# EAGLE design NeoCoreShield (EAGLE 9.6.2)
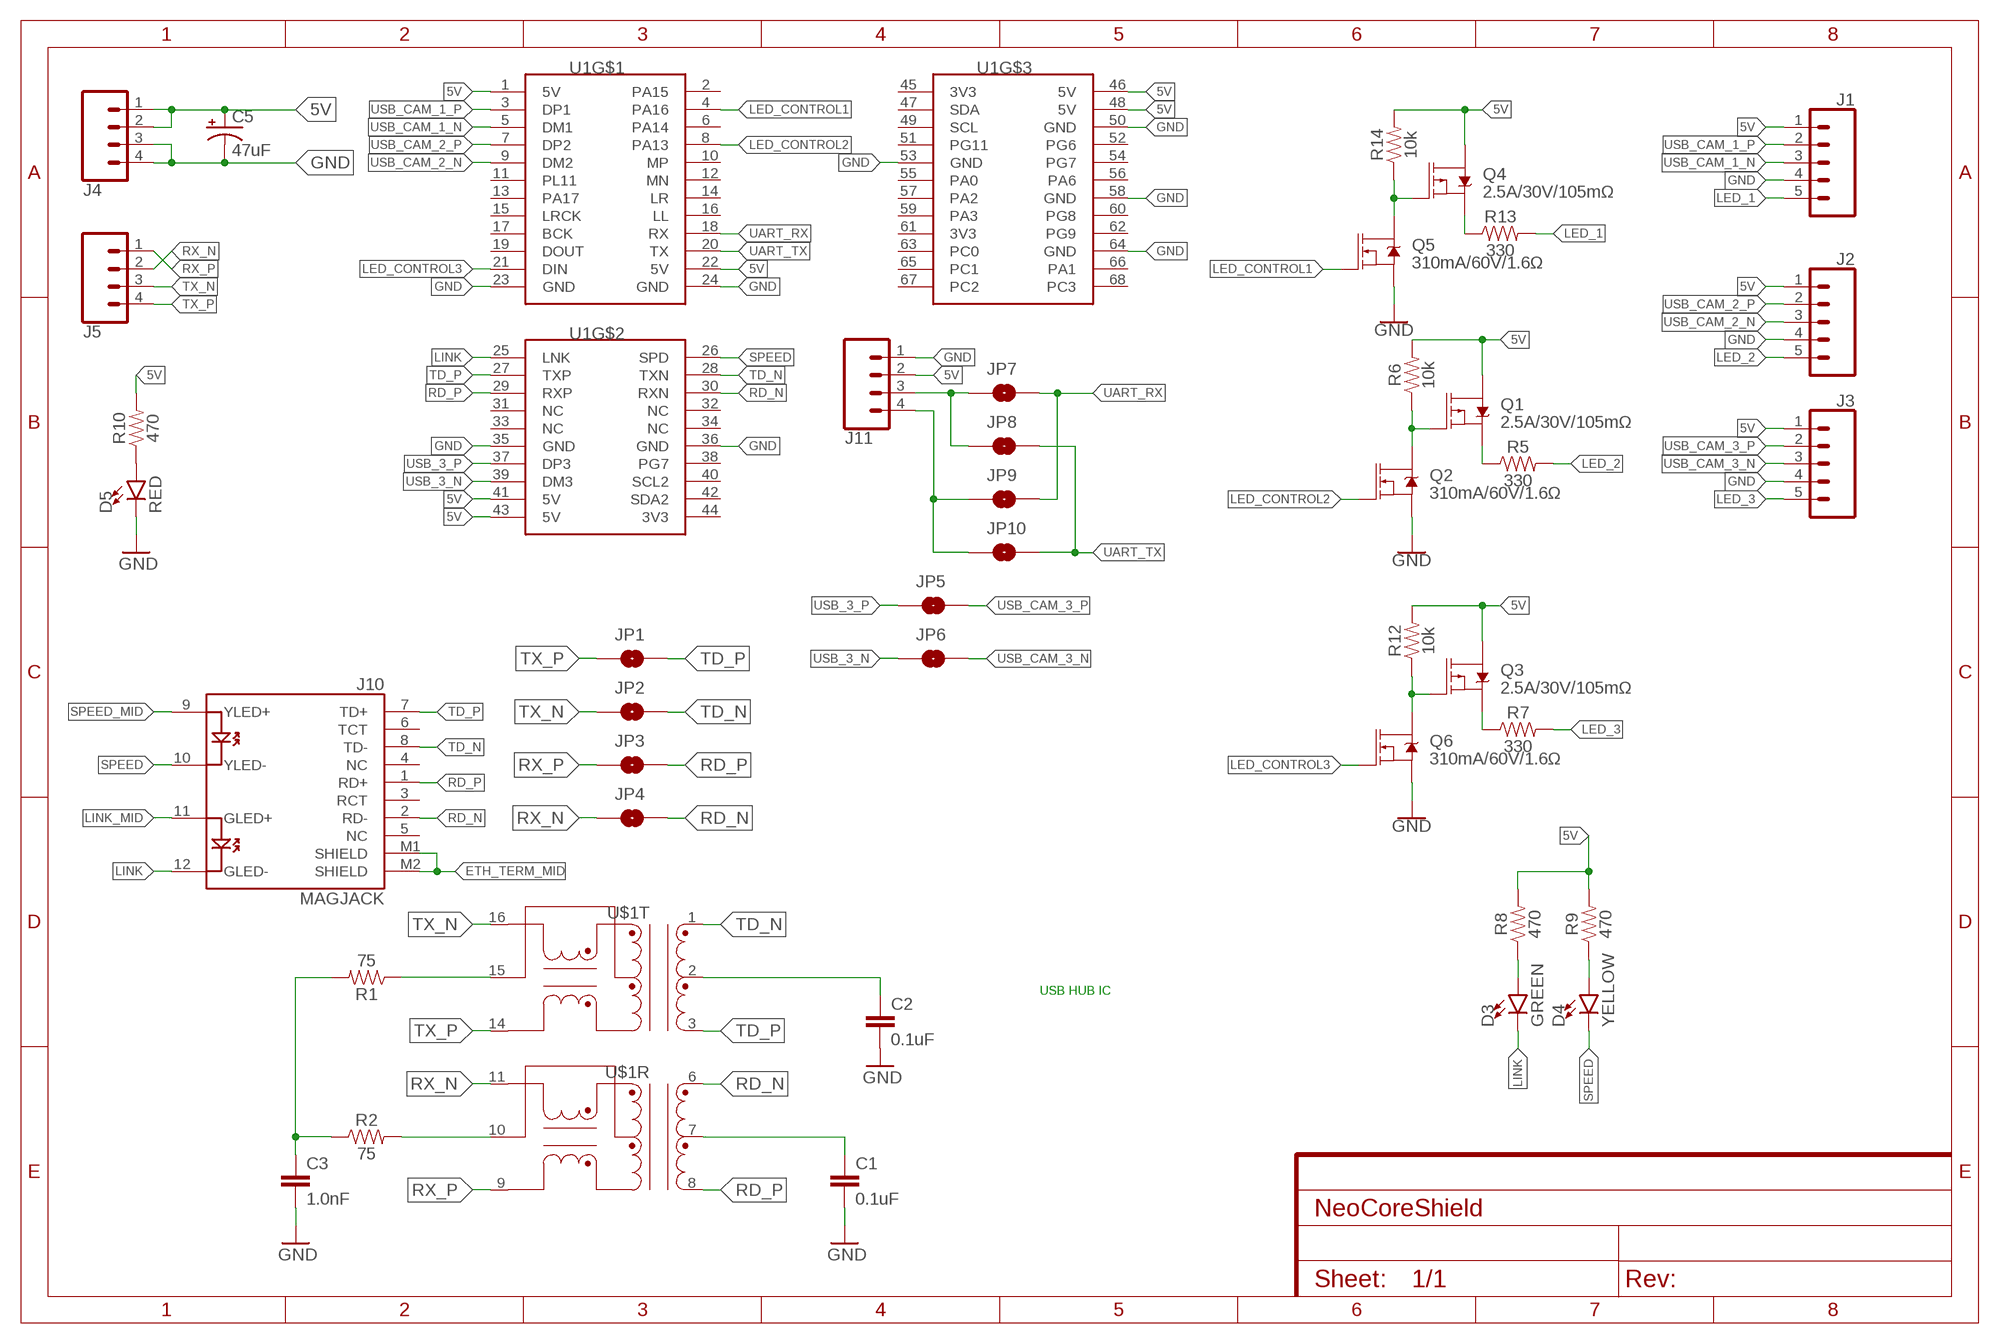
[diagram p0: schematic, sheet 1]

## Parts
C1  0.1uF  0.1UF-0603-25V-(+80/-20%)  [0603]
C2  0.1uF  0.1UF-0603-25V-(+80/-20%)  [0603]
C3  1.0nF  1.0UF-1206-50V-10%  [1206]
C5  47uF  47UF-POLAR-PANASONIC_D-35V-20%  [PANASONIC_D]
D3  GREEN  LED-0805  [0805]
D4  YELLOW  LED-0805  [0805]
D5  RED  LED-0805  [0805]
J1  PXC-PTSM-05-RA  [PXC-PTSM-05-RA]
J2  PXC-PTSM-05-RA  [PXC-PTSM-05-RA]
J3  PXC-PTSM-05-RA  [PXC-PTSM-05-RA]
J4  PXC-PTSM-04-RA-1778641  [PXC-PTSM-04-RA-1778641]
J5  PXC-PTSM-04-RA-1778641  [PXC-PTSM-04-RA-1778641]
J10  MAGJACK  [MAGJACK]
J11  CONN_04  [1X04]
JP1  JUMPER-SMT_2_NO_SILK  [SMT-JUMPER_2_NO_SILK]
JP2  JUMPER-SMT_2_NO_SILK  [SMT-JUMPER_2_NO_SILK]
JP3  JUMPER-SMT_2_NO_SILK  [SMT-JUMPER_2_NO_SILK]
JP4  JUMPER-SMT_2_NO_SILK  [SMT-JUMPER_2_NO_SILK]
JP5  JUMPER-SMT_2_NO_SILK  [SMT-JUMPER_2_NO_SILK]
JP6  JUMPER-SMT_2_NO_SILK  [SMT-JUMPER_2_NO_SILK]
JP7  JUMPER-SMT_2_NO_SILK  [SMT-JUMPER_2_NO_SILK]
JP8  JUMPER-SMT_2_NO_SILK  [SMT-JUMPER_2_NO_SILK]
JP9  JUMPER-SMT_2_NO_SILK  [SMT-JUMPER_2_NO_SILK]
JP10  JUMPER-SMT_2_NO_SILK  [SMT-JUMPER_2_NO_SILK]
Q1  2.5A/30V/105mΩ  MOSFET_PCH-DMG2307L  [SOT23-3]
Q2  310mA/60V/1.6Ω  MOSFET-NCH-2N7002PW  [SOT323]
Q3  2.5A/30V/105mΩ  MOSFET_PCH-DMG2307L  [SOT23-3]
Q4  2.5A/30V/105mΩ  MOSFET_PCH-DMG2307L  [SOT23-3]
Q5  310mA/60V/1.6Ω  MOSFET-NCH-2N7002PW  [SOT323]
Q6  310mA/60V/1.6Ω  MOSFET-NCH-2N7002PW  [SOT323]
R1  75  75KOHM-0603-1/10W-1%  [0603]
R2  75  75KOHM-0603-1/10W-1%  [0603]
R5  330  RESISTOR0805  [0805]
R6  10k  10KOHM-0603-1/10W-1%  [0603]
R7  330  RESISTOR0805  [0805]
R8  470  0OHM-0603-1/10W-5%  [0603]
R9  470  0OHM-0603-1/10W-5%  [0603]
R10  470  0OHM-0603-1/10W-5%  [0603]
R12  10k  10KOHM-0603-1/10W-1%  [0603]
R13  330  RESISTOR0805  [0805]
R14  10k  10KOHM-0603-1/10W-1%  [0603]
U1  NANO_PI_NEO_CORE  [NANO_PI_NEO_CORE]
U$1  ETH-TRANS  [SOIC-16-WIDE]

## Nets
5V: C5.+ J1.1 J2.1 J3.1 J4.1 J4.2 J11.2 Q1.3(D) Q3.3(D) Q4.3(D) R6.2 R8.2 R9.2 R10.2 R12.2 R14.2 U1.1(5V) U1.22(5V) U1.41(5V) U1.43(5V) U1.46(5V) U1.48(5V)
ETH_TD0_GND: C1.1 U$1.7(R:CT)
ETH_TD1_GND: C2.1 U$1.2(T:CT)
ETH_TERM_MID: C3.1 J10.M1(SHIELD) J10.M2(SHIELD) R1.2 R2.1
GND: C1.2 C2.2 C3.2 C5.- D5.C J1.4 J2.4 J3.4 J4.3 J4.4 J11.1 Q2.2(S) Q5.2(S) Q6.2(S) U1.23(GND) U1.24(GND) U1.35(GND) U1.36(GND) U1.50(GND) U1.53(GND) U1.58(GND) U1.64(GND)
LED_1: J1.5 R13.2
LED_2: J2.5 R5.2
LED_3: J3.5 R7.2
LED_CONTROL1: Q5.1(G) U1.4(PA16)
LED_CONTROL2: Q2.1(G) U1.8(PA13)
LED_CONTROL3: Q6.1(G) U1.21(DIN)
LINK: D3.C J10.12(GLED-) U1.25(LNK)
LINK_MID: D3.A J10.11(GLED+) R8.1
N$3: R2.2 U$1.10(R:XCT)
N$5: Q3.2(S) R7.1
N$6: Q3.1(G) Q6.3(D) R12.1
N$7: D5.A R10.1
N$8: Q1.2(S) R5.1
N$9: Q1.1(G) Q2.3(D) R6.1
N$10: Q4.2(S) R13.1
N$11: R1.1 U$1.15(T:XCT)
N$12: Q4.1(G) Q5.3(D) R14.1
RD_N [diff]: J10.2(RD-) JP4.2 U1.30(RXN) U$1.6(R:D+)
RD_P [diff]: J10.1(RD+) JP3.2 U1.29(RXP) U$1.8(R:D-)
RX_N [diff]: J5.2 JP4.1 U$1.11(R:X+)
RX_P [diff]: J5.1 JP3.1 U$1.9(R:X-)
SPEED: D4.C J10.10(YLED-) U1.26(SPD)
SPEED_MID: D4.A J10.9(YLED+) R9.1
TD_N [diff]: J10.8(TD-) JP2.2 U1.28(TXN) U$1.1(T:D+)
TD_P [diff]: J10.7(TD+) JP1.2 U1.27(TXP) U$1.3(T:D-)
TX_N [diff]: J5.3 JP2.1 U$1.16(T:X+)
TX_P [diff]: J5.4 JP1.1 U$1.14(T:X-)
UART_RX: JP7.2 JP9.2 U1.18(RX)
UART_RX_TX: J11.3 JP7.1 JP8.1
UART_TX: JP8.2 JP10.2 U1.20(TX)
UART_TX_RX: J11.4 JP9.1 JP10.1
USB_3_N [diff]: JP6.1 U1.39(DM3)
USB_3_P [diff]: JP5.1 U1.37(DP3)
USB_CAM_1_N [diff]: J1.3 U1.5(DM1)
USB_CAM_1_P [diff]: J1.2 U1.3(DP1)
USB_CAM_2_N [diff]: J2.3 U1.9(DM2)
USB_CAM_2_P [diff]: J2.2 U1.7(DP2)
USB_CAM_3_N [diff]: J3.3 JP6.2
USB_CAM_3_P [diff]: J3.2 JP5.2
Unconnected: J10.3(RCT) J10.4(NC) J10.5(NC) J10.6(TCT) U1.2(PA15) U1.6(PA14) U1.10(MP) U1.11(PL11) U1.12(MN) U1.13(PA17) U1.14(LR) U1.15(LRCK) U1.16(LL) U1.17(BCK) U1.19(DOUT) U1.31(NC) U1.32(NC) U1.33(NC) U1.34(NC) U1.38(PG7) U1.40(SCL2) U1.42(SDA2) U1.44(3V3) U1.45(3V3) U1.47(SDA) U1.49(SCL) U1.51(PG11) U1.52(PG6) U1.54(PG7) U1.55(PA0) U1.56(PA6) U1.57(PA2) U1.59(PA3) U1.60(PG8) U1.61(3V3) U1.62(PG9) U1.63(PC0) U1.65(PC1) U1.66(PA1) U1.67(PC2) U1.68(PC3)

## Notes on the sheet
- USB HUB IC

## Library data of the parts
C1 C2 = SparkFun-Capacitors:0.1UF: 0.1µF ceramic capacitors A capacitor is a passive two-terminal electrical component used to store electrical energy temporarily in an electric field.; PROD_ID: CAP-00810
C3 = SparkFun-Capacitors:1.0UF: 1µF ceramic capacitors A capacitor is a passive two-terminal electrical component used to store electrical energy temporarily in an electric field.; PROD_ID: CAP-09822; VALUE: 1.0uF
C5 = Panasonic 47 uF cap - EEE-1CA470SP:47UF-POLAR: 47µF polarized capacitors A capacitor is a passive two-terminal electrical component used to store electrical energy temporarily in an electric field.; PROD_ID: CAP-08478
D3-D5 = LED-0805:LED-0805; VALUE: COLOR
J1-J3 = Phoenix Contact PTSM 5 pin:PXC-PTSM-05-RA
J4 J5 = Phoenix Contact PTSM-04-V-1778573:PXC-PTSM-04-RA-1778641
J10 = SparkFun-Connectors:MAGJACK: MAGJACK: RJ-45 with LEDs This is a single port, RJ45 ethernet jacks with built in transformer (magnetics), status LEDs, and shielding. Here is the connector we sell at SparkFun: RJ45 Ethernet MagJack-Compatible <https://www.sparkfun.com/products/8534> (PRT-08534) Datasheet <http://www.sparkfun.com/datasheets/Prototyping/MagJack.pdf> It is used on this SparkFun product: SparkFun RJ45 MagJack Breakout <https://www.sparkfun.com/products/13021> (BOB-13021); PROD_ID: CONN-09556; SF_ID: PRT-08534
J11 = SparkFun-Connectors:CONN_04: Multi connection point. Often used as Generic Header-pin footprint for 0.1 inch spaced/style header connections On any of the 0.1 inch spaced packages, you can populate with these: Break Away Headers - Straight <https://www.sparkfun.com/products/116> (PRT-00116) Break Away Male Headers - Right Angle <https://www.sparkfun.com/products/553> (PRT-00553) Female Headers <https://www.sparkfun.com/products/115> (PRT-00115) Break Away Headers - Machine Pin <https://www.sparkfun.com/products/117> (PRT-00117) Break Away Female Headers - Swiss Machine Pin <https://www.sparkfun.com/products/743> (PRT-00743) For SCREWTERMINALS and SPRING TERMINALS visit here: Screw Terimnals on SparkFun.com <https://www.sparkfun.com/search/results?term=Screw+Terminals> (5mm/3.5mm/2.54mm spacing) This device is also useful as a general connection point to wire up your design to another part of your project. Our various solder wires solder well into these plated through hole pads. Hook-Up Wire - Assortment (Stranded, 22 AWG) <https://www.sparkfun.com/products/11375> (PRT-11375) Hook-Up Wire - Assortment (Solid Core, 22 AWG) <https://www.sparkfun.com/products/11367> (PRT-11367) View the entire wire category on our website here <https://www.sparkfun.com/categories/141> Special notes: Molex polarized connector foot print use with SKU : PRT-08231 with associated crimp pins and housings. 1MM SMD Version SKU: PRT-10208; PROD_ID: CONN-09696
JP1-JP10 = SparkFun-Jumpers:JUMPER-SMT_2_NO: Normally open jumper This jumper has two pads in close proximity to each other. Apply solder to close the connection. Round pads are easier to solder for beginners, but are a lot larger. SparkFun Product that uses the round pads: SparkFun EL Sequencer <https://www.sparkfun.com/products/12781>
Q1 Q3 Q4 = SparkFun-DiscreteSemi:MOSFET_PCH: P-channel MOSFETs Voltage controlled devices that allow control of high current outputs. SparkFun Products: SparkFun ESP32 Thing <https://www.sparkfun.com/products/13907> SparkFun ESP8266 Thing <https://www.sparkfun.com/products/13231>; PROD_ID: TRANS-11308
Q2 Q5 Q6 = SparkFun-DiscreteSemi:MOSFET-NCH: N-channel MOSFETs Voltage controlled devices that allow control of high current outputs. SparkFun Products: SparkFun OpenScale <https://www.sparkfun.com/products/13261> SparkFun Digital Sandbox <https://www.sparkfun.com/products/12651> SparkFun Monster Moto Shield <https://www.sparkfun.com/products/10182> SparkFun MOSFET Power Controller <https://www.sparkfun.com/products/11214>; PROD_ID: TRANS-11151
R1 R2 = SparkFun-Resistors:75KOHM: 75Ω resistor A resistor is a passive two-terminal electrical component that implements electrical resistance as a circuit element. Resistors act to reduce current flow, and, at the same time, act to lower voltage levels within circuits. - Wikipedia; PROD_ID: RES-09737
R5 R7 R13 = SparkFun-Resistors:RESISTOR: Generic Resistor Package
R6 R12 R14 = SparkFun-Resistors:10KOHM: 10kΩ resistor A resistor is a passive two-terminal electrical component that implements electrical resistance as a circuit element. Resistors act to reduce current flow, and, at the same time, act to lower voltage levels within circuits. - Wikipedia; PROD_ID: RES-00824
R8-R10 = SparkFun-Resistors:0OHM: 0Ω resistor A resistor is a passive two-terminal electrical component that implements electrical resistance as a circuit element. Resistors act to reduce current flow, and, at the same time, act to lower voltage levels within circuits. - Wikipedia; PROD_ID: RES-08609; VALUE: 0
U1 = NanoPiNeoCore:NANO_PI_NEO_CORE
U$1 = ethernet transformer:ETH-TRANS

## Net classes
0 default: width 0.203 mm
1 diff: width 0.203 mm, clearance 0.203 mm

## Board
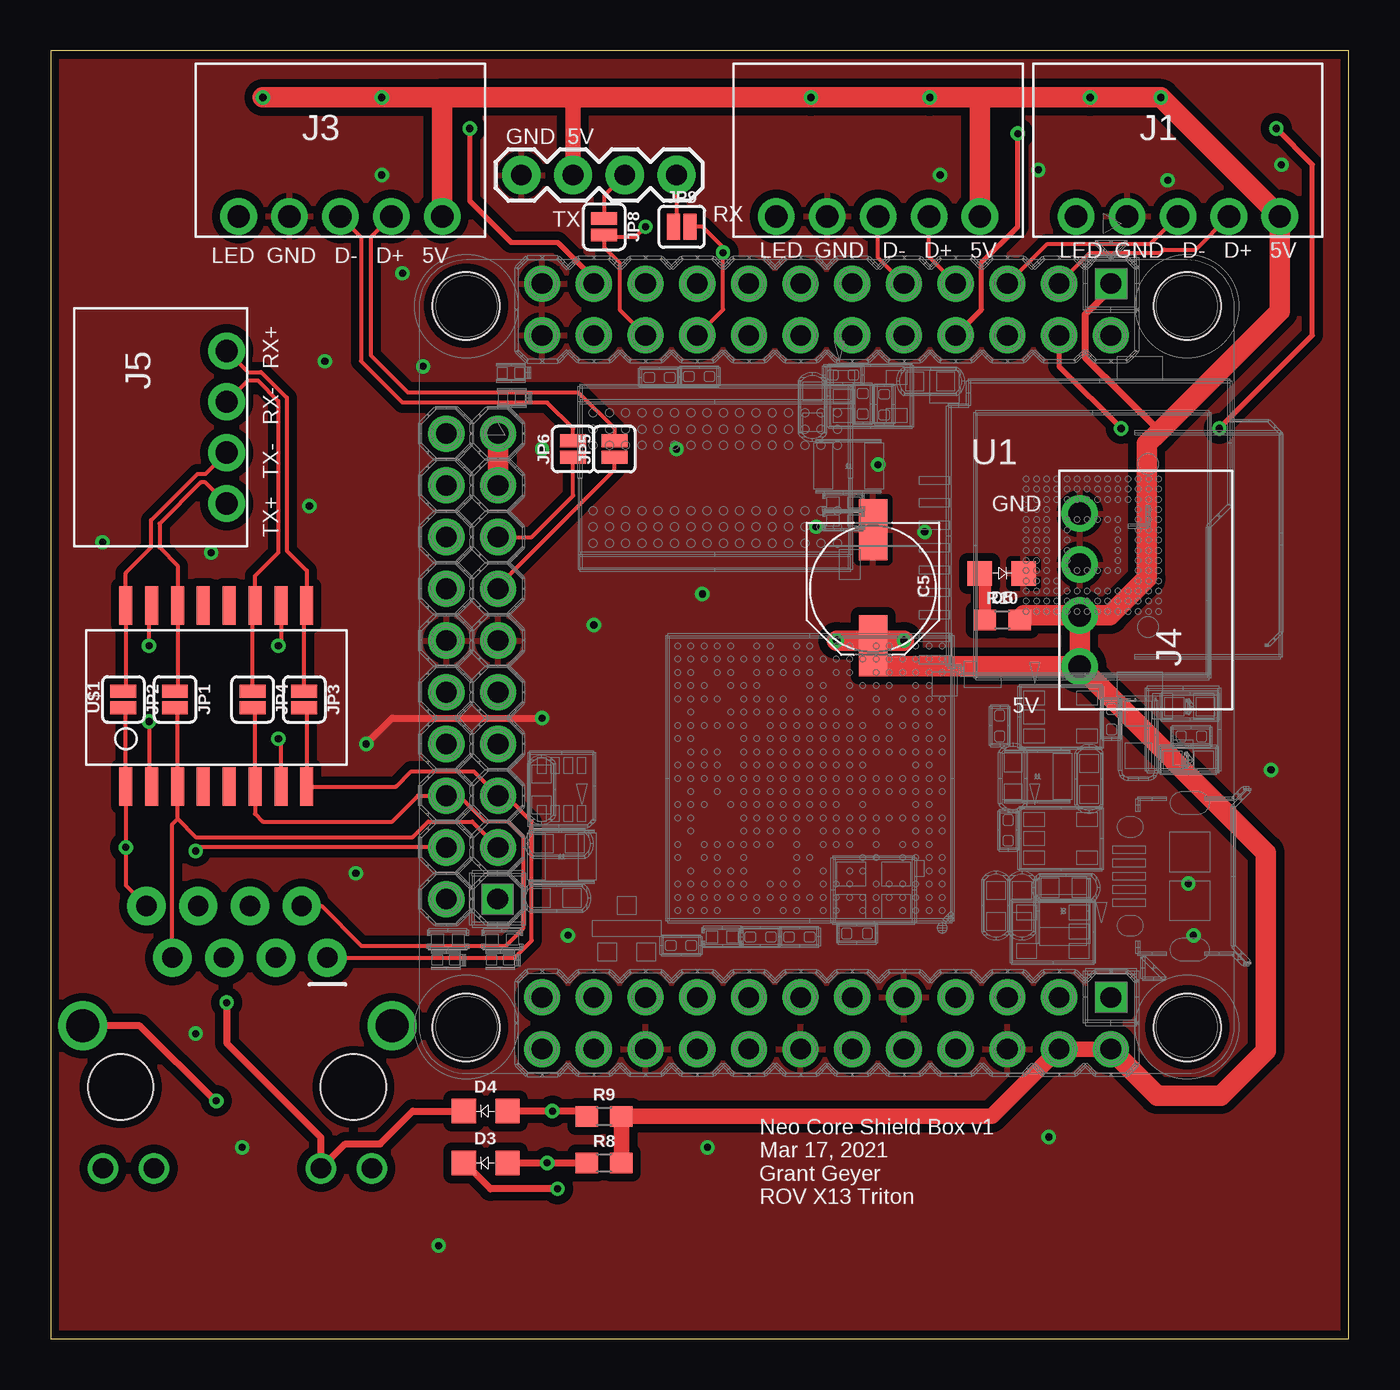
[diagram p1: board, top side]
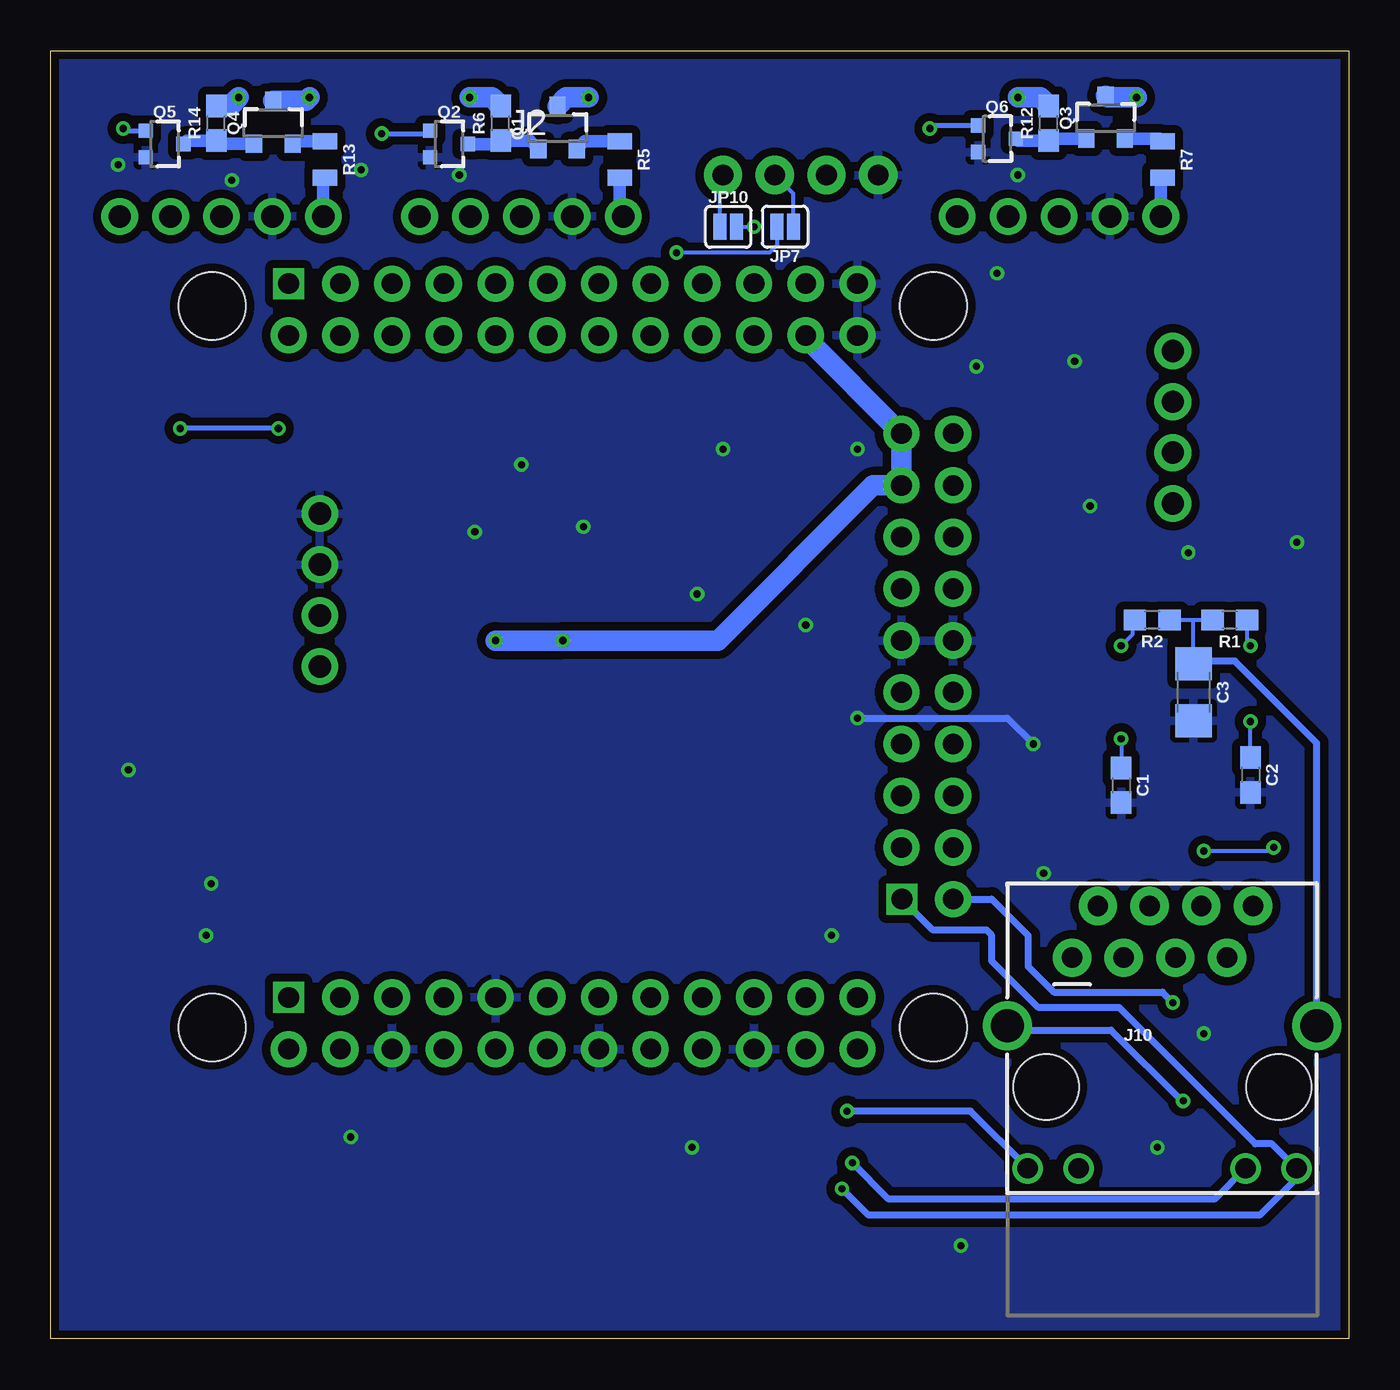
[diagram p2: board, bottom side, seen from below]

Size 63.75 x 63.25 mm. Coordinates in mm from the lower left corner, seen from the top.
Outline: 0,0 63.75,0 63.75,63.25 0,63.25 0,0
Copper layers (1*16): Top 0.0356mm / dielectric 1.5011mm / Bottom 0.0356mm
Design rules "ECE_Senior_Design": minimum track width 8mil, minimum drill 13mil, track to track 8mil, track to pad 8mil, pad to pad 6mil, via to via 8mil, smd to smd 6mil, copper to edge 15mil, drill to drill 8mil, minimum pad ring 7mil, minimum via ring 7mil, stop-mask expansion 3mil, vias tented up to drill 0mil, thermal gap 10mil

### Footprints (pad centres in the part's own frame; a part is rotated, then mirrored left to right if it is on the bottom)
0603 = smd 1.1 x 1: 1 -0.85,0; 2 0.85,0
1206 = smd 1.6 x 1.8: 1 -1.4,0; 2 1.4,0
PANASONIC_D = smd 3 x 1.4: + 2.8,0; - -2.9,0
0805 = smd 1.2 x 1.2: A 1.1,0; C -1.05,0
PXC-PTSM-05-RA = drill 1.1 pad 1.8: 1 -5,0; 2 -2.5,0; 3 0,0; 4 2.5,0; 5 5,0
PXC-PTSM-04-RA-1778641 = drill 1.1 pad 1.8: 1 0,0; 2 2.5,0; 3 5,0; 4 7.5,0
MAGJACK = drill 1 pad 1.88: 1 3.175,17.445; 2 4.445,19.985; 3 5.715,17.445; 4 6.985,19.985; 5 8.255,17.445; 6 9.525,19.985; 7 10.795,17.445; 8 12.065,19.985 | drill 1 pad 1.27: 9 1,7.1; 10 3.5,7.1; 11 11.7,7.1; 12 14.2,7.1 | drill 1.6 pad 2.184: M1 0,14.1; M2 15.2,14.1 | hole 3.2: 1.905,11.095; 13.335,11.095
1X04 = drill 1.016 pad 1.88: 1 0,0; 2 2.54,0; 3 5.08,0; 4 7.62,0
SMT-JUMPER_2_NO_SILK = smd 0.635 x 1.27: 1 -0.406,0; 2 0.406,0
SOT23-3 = smd 0.8 x 0.9: 1 -0.95,-1; 2 0.95,-1; 3 0,1.1
SOT323 = smd 0.7 x 0.7: 1 -0.65,-0.925; 2 0.65,-0.925; 3 0,0.925
0805' = smd 0.8 x 1.2: 1 -0.9,0; 2 0.9,0
NANO_PI_NEO_CORE = drill 1.016 square: 1 0,0; 25 30.124,30.226; 45 0,35.052 | drill 1.016 pad 1.778: 2 0,2.54; 3 2.54,0; 4 2.54,2.54; 5 5.08,0; 6 5.08,2.54; 7 7.62,0; 8 7.62,2.54; 9 10.16,0; 10 10.16,2.54; 11 12.7,0; 12 12.7,2.54; 13 15.24,0; 14 15.24,2.54; 15 17.78,0; 16 17.78,2.54; 17 20.32,0; 18 20.32,2.54; 19 22.86,0; 20 22.86,2.54; 21 25.4,0; 22 25.4,2.54; 23 27.94,0; 24 27.94,2.54; 26 32.639,30.226; 27 30.099,27.686; 28 32.639,27.686; 29 30.099,25.146; 30 32.639,25.146; 31 30.099,22.606; 32 32.639,22.606; 33 30.099,20.066; 34 32.639,20.066; 35 30.099,17.526; 36 32.639,17.526; 37 30.099,14.986; 38 32.639,14.986; 39 30.099,12.446; 40 32.639,12.446; 41 30.099,9.906; 42 32.639,9.906; 43 30.099,7.366; 44 32.639,7.366; 46 0,37.592; 47 2.54,35.052; 48 2.54,37.592; 49 5.08,35.052; 50 5.08,37.592; 51 7.62,35.052; 52 7.62,37.592; 53 10.16,35.052; 54 10.16,37.592; 55 12.7,35.052; 56 12.7,37.592; 57 15.24,35.052; 58 15.24,37.592; 59 17.78,35.052; 60 17.78,37.592; 61 20.32,35.052; 62 20.32,37.592; 63 22.86,35.052; 64 22.86,37.592; 65 25.4,35.052; 66 25.4,37.592; 67 27.94,35.052; 68 27.94,37.592 | hole 3.302: -3.759,1.092; 31.674,1.092; 31.674,36.525; -3.759,36.525
SOIC-16-WIDE = smd 0.64 x 1.9: 1 -4.445,-4.38; 2 -3.175,-4.38; 3 -1.905,-4.38; 4 -0.635,-4.38; 5 0.635,-4.38; 6 1.905,-4.38; 7 3.175,-4.38; 8 4.445,-4.38; 9 4.445,4.51; 10 3.175,4.51; 11 1.905,4.51; 12 0.635,4.51; 13 -0.635,4.51; 14 -1.905,4.51; 15 -3.175,4.51; 16 -4.445,4.51

### Placement (x,y rotation side)
C1  11.18,27.18 270 bottom
C2  4.83,27.69 270 bottom
C3  7.62,31.75 270 bottom
C5  40.39,36.83 270 top
D3  21.34,8.64 0 top
D4  21.34,11.18 0 top
D5  46.74,37.59 180 top
J1  55.37,55.12 180 top
J2  40.64,55.12 180 top
J3  14.22,55.12 180 top
J4  50.55,33.02 90 top
J5  8.64,48.51 270 top
J10  16.76,1.27 0 bottom
J11  23.11,57.15 0 top
JP1  6.1,31.39 270 top
JP2  3.56,31.39 270 top
JP3  12.45,31.39 270 top
JP4  9.91,31.39 270 top
JP5  27.69,43.69 90 top
JP6  25.65,43.69 90 top
JP7  27.69,54.61 180 bottom
JP8  27.18,54.61 270 top
JP9  30.99,54.61 0 top
JP10  30.48,54.61 0 bottom
Q1  38.86,59.44 0 bottom
Q2  44.2,58.67 270 bottom
Q3  11.94,59.94 0 bottom
Q4  52.83,59.69 0 bottom
Q5  58.17,58.67 270 bottom
Q6  17.27,58.93 270 bottom
R1  5.84,35.31 180 bottom
R2  9.65,35.31 180 bottom
R5  330  [0805']  35.81,57.91 270 bottom
R6  41.66,59.69 90 bottom
R7  330  [0805']  9.14,57.91 270 bottom
R8  27.18,8.64 0 top
R9  27.18,10.92 0 top
R10  46.74,35.31 0 top
R12  14.73,59.69 90 bottom
R13  330  [0805']  50.29,57.91 270 bottom
R14  55.63,59.69 90 bottom
U1  52.07,51.82 180 top
U$1  8.13,31.5 0 top

### Tracks (layer width: path | path; a pad name or v marks a point on that pad's centre or on a via)
5V  (via drill 0.35)
  Top 0.356: U1.1 52.07,51.51 50.8,50.29 50.8,48.21 54.48,44.58
  Top 0.762: R8.2 R9.2 46.23,10.92 U1.48 U1.46 | J11.2 25.65,60.96
  Top 1.016: J4.1 J4.2 | J4.2 47.8,35.52 R10.2 | J4.1 40.64,33.02 40.39,33.27 C5.+ | J4.2 52.03,35.52 53.85,37.34 53.85,43.94 54.48,44.58 60.37,50.47 J1.1 v54.53,60.96 v51.05,60.96 45.72,60.96 | 45.72,60.96 v43.18,60.96 v37.34,60.96 25.65,60.96 19.05,60.96 | J3.1 19.22,60.79 19.05,60.96 | v10.41,60.96 v16.26,60.96 19.05,60.96 | J2.1 45.64,60.88 45.72,60.96 | U1.43 U1.41 | v38.61,34.29 40.13,34.29 C5.+ | C5.+ 40.65,34.29 v41.91,34.29 | J4.1 59.69,23.88 59.69,14.15 57.48,11.94 54.36,11.94 U1.46
  Bottom 1.016: Q3.3 11.85,60.96 v10.41,60.96 | R12.2 15.15,60.96 v16.26,60.96 | Q1.3 38.44,60.96 v37.34,60.96 | R6.2 42.08,60.96 v43.18,60.96 | Q4.3 51.22,60.79 v51.05,60.96 | R14.2 54.95,60.54 v54.53,60.96 | U1.22 26.67,49.15 U1.43 U1.41 23.37,41.91 30.99,34.29 v38.61,34.29 v41.91,34.29
ETH_TD0_GND  (via drill 0.35)
  Top 0.203: U$1.7 11.3,29.34 v11.18,29.46
  Bottom 0.203: v11.18,29.46 C1.1
ETH_TD1_GND  (via drill 0.35)
  Top 0.203: U$1.2 4.83,27.24 v4.83,30.31
  Bottom 0.203: C2.1 v4.83,30.31
ETH_TERM_MID  (via drill 0.35)
  Top 0.356: v8.13,11.68 8.06,11.68 4.38,15.37 J10.M2
  Bottom 0.203: R2.1 7.62,35.31 | 7.62,35.31 R1.2 | C3.1 7.62,33.27 7.62,35.31
  Bottom 0.356: J10.M2 1.56,29.25 5.59,33.27 7.62,33.27 | J10.M1 16.55,15.16 11.67,15.16 8.2,11.68 v8.13,11.68
GND  (via drill 0.35)
  Top 0.356: v15.49,29.21 16.76,30.48 v24.13,30.48
  Bottom 0.356: v24.13,30.48 16.76,30.48 v15.49,29.21
  other vias: 12.7,40.89 7.87,38.61 2.54,39.12 14.99,22.86 7.11,14.99 9.4,9.4 19.05,4.57 32.26,9.4 49.02,9.91 55.88,22.35 56.13,19.81 59.94,27.94 42.93,39.62 37.59,39.88 40.64,42.93 16.26,57.15 43.69,57.15 48.51,57.4 54.86,56.9 60.45,57.66 13.46,48.01 24.13,43.69 17.27,52.32 18.29,47.75 30.73,43.69 32,36.58 26.67,35.05 25.4,19.81
  pour Top (isolate 0.406, rank 6): -1.78,-2.54 112.01,-2.54 112.01,136.65 -1.78,136.65
  pour Bottom (isolate 0.406, rank 6): -1.02,-1.78 107.44,-1.78 107.44,133.1 -1.02,133.1
LED_1
  Bottom 0.61: R13.2 50.37,56.93 J1.5
LED_2
  Bottom 0.61: R5.2 35.81,55.29 J2.5
LED_3
  Bottom 0.61: R7.2 9.22,56.93 J3.5
LED_CONTROL1  (via drill 0.35)
  Top 0.254: U1.4 49.53,47.75 v52.58,44.7 | v57.4,44.7 61.98,49.28 61.98,57.66 v60.2,59.44
  Bottom 0.254: v52.58,44.7 v57.4,44.7 | v60.2,59.44 60.09,59.32 Q5.1
LED_CONTROL2  (via drill 0.35)
  Top 0.254: U1.8 45.72,50.55 45.72,52.83 47.5,54.61 v47.5,59.18
  Bottom 0.254: v47.5,59.18 45.26,59.18 Q2.1
LED_CONTROL3  (via drill 0.35)
  Top 0.254: v20.57,59.44 20.57,55.88 22.61,53.85 24.89,53.85 26.67,52.07 U1.21
  Bottom 0.254: Q6.1 20.43,59.58 v20.57,59.44
LINK  (via drill 0.35)
  Top 0.356: v24.89,7.37 21.59,7.37 20.32,8.64 D3.C
  Bottom 0.356: U1.25 20.42,20.07 17.78,20.07 17.53,19.81 17.53,18.54 15.24,16.26 11.27,16.26 4.59,9.57 3.77,9.57 J10.12 2.56,7.86 4.33,6.1 23.62,6.1 v24.89,7.37
LINK_MID  (via drill 0.35)
  Top 0.356: D3.A v24.38,8.64 R8.1
  Bottom 0.356: J10.11 6.58,6.86 22.61,6.86 v24.38,8.64
N$3  (via drill 0.35)
  Top 0.203: U$1.10 11.3,34.16 v11.18,34.04
  Bottom 0.203: R2.2 10.6,35.31 10.6,34.61 v11.18,34.04
N$5
  Bottom 0.61: R7.1 9.28,58.94 Q3.2
N$6
  Bottom 0.61: Q3.1 14.63,58.94 R12.1 16.26,58.84 Q6.3
N$7
  Top 0.61: D5.A 45.89,37.34 R10.1
N$8
  Bottom 0.61: R5.1 37.54,58.81 Q1.2
N$9
  Bottom 0.61: Q2.3 41.82,58.67 R6.1 40.22,58.84 Q1.1
N$10
  Bottom 0.61: R13.1 51.76,58.81 Q4.2
N$11  (via drill 0.35)
  Top 0.203: v4.83,34.04 4.83,35.88 U$1.15
  Bottom 0.203: R1.1 4.99,34.2 v4.83,34.04
N$12
  Bottom 0.61: Q4.1 55.48,58.69 R14.1 57.08,58.84 Q5.3
RD_N
  Top 0.203: JP4.2 10.03,30.86 U$1.6 10.03,25.78 10.41,25.4 16.76,25.4 18.03,26.67 U1.30 20.07,26.67 21.34,25.4 22.45,25.4 23.22,24.64 23.22,20.17 22.35,19.3 15.24,19.3 13.29,21.25 J10.2
RD_P
  Top 0.203: JP3.2 12.57,30.86 U$1.8 16.96,27.12 17.7,27.86 20.78,27.86 U1.29 22.35,26.67 23.62,25.4 23.62,19.56 22.78,18.71 J10.1
RX_N
  Top 0.203: J5.2 9.68,47.06 10.16,47.06 11.18,46.05 11.18,38.61 10.03,37.47 U$1.11 9.91,35.88 JP4.1
RX_P
  Top 0.203: J5.1 9.68,47.47 10.33,47.47 11.58,46.21 11.58,38.71 12.57,37.72 U$1.9 12.45,35.88 JP3.1
SPEED  (via drill 0.35)
  Top 0.356: v8.64,16.51 8.64,14.52 13.26,9.89 J10.10 14.46,9.57 16.18,9.57 17.78,11.18 D4.C
  Bottom 0.356: U1.26 17.53,21.59 15.75,19.81 15.75,18.29 14.48,17.02 9.14,17.02 v8.64,16.51
SPEED_MID  (via drill 0.35)
  Top 0.356: D4.A v24.64,11.18 26.07,11.18 R9.1
  Bottom 0.356: J10.9 18.57,11.18 v24.64,11.18
TD_N  (via drill 0.35)
  Top 0.203: JP2.2 3.68,30.86 U$1.1 v3.68,24.13 3.68,22.27 J10.8 | U1.28 7.29,24.13 v7.11,23.95
  Bottom 0.203: v7.11,23.95 3.86,23.95 v3.68,24.13
TD_P
  Top 0.203: JP1.2 6.22,30.86 U$1.3 6.22,25.53 | J10.7 5.97,25.27 6.22,25.53 | U1.27 20.7,25.4 18.54,25.4 17.78,24.64 7.11,24.64 6.22,25.53
TX_N
  Top 0.203: J5.3 7.59,42.47 7.2,42.47 4.93,40.2 4.93,38.86 3.68,37.62 U$1.16 3.68,31.93 JP2.1
TX_P
  Top 0.203: J5.4 7.59,42.06 7.37,42.06 5.33,40.03 5.33,38.86 6.22,37.97 U$1.14 6.22,31.93 JP1.1
UART_RX  (via drill 0.35)
  Top 0.203: U1.18 33.02,50.55 v33.02,53.34 33.02,53.59 32,54.61 JP9.2
  Bottom 0.203: JP7.2 28.09,53.7 28.45,53.34 v33.02,53.34
UART_RX_TX
  Top 0.203: J11.3 27.18,56.13 JP8.1
  Bottom 0.203: JP7.1 27.28,56.24 J11.3
UART_TX  (via drill 0.35)
  Top 0.203: JP8.2 27.18,54.1 | 27.18,54.1 27.18,53.59 27.94,52.83 27.94,50.55 U1.20 | v29.21,54.61 28.7,54.1 27.18,54.1
  Bottom 0.203: JP10.2 v29.21,54.61
UART_TX_RX
  Top 0.203: J11.4 30.73,54.76 JP9.1
  Bottom 0.203: JP10.1 30.89,57 J11.4
USB_3_N
  Top 0.203: U1.39 23.62,39.37 25.65,41.4 JP6.1
USB_3_P
  Top 0.203: U1.37 21.97,36.96 27.69,42.67 JP5.1
USB_CAM_1_N
  Top 0.203: U1.5 48.92,53.75 54,53.75 J1.3
USB_CAM_1_P
  Top 0.203: U1.3 51.05,53.34 54.53,53.34 54.68,53.49 56.25,53.49 J1.2
USB_CAM_2_N
  Top 0.203: U1.9 40.64,53.09 J2.3
USB_CAM_2_P
  Top 0.203: U1.7 43.14,53.13 J2.2
USB_CAM_3_N
  Top 0.203: JP6.2 25.65,44.7 24.38,45.97 17.27,45.97 15.24,48.01 15.24,54.1 J3.3
USB_CAM_3_P
  Top 0.203: J3.2 15.71,54.1 15.71,48.3 17.53,46.48 25.91,46.48 27.69,44.7 JP5.2

### Text on the board
tNames: GND 5V | TX | RX | LED GND D- D+ 5V | LED GND D- D+ 5V | LED GND D- D+ 5V | GND | TX+ TX- RX- RX+ | 5V | Neo Core Shield Box v1 / Mar 17, 2021 / Grant Geyer / ROV X13 Triton